# EasyEDA Pro project 测试用途.eprj, board ESP32 CH343下载电路
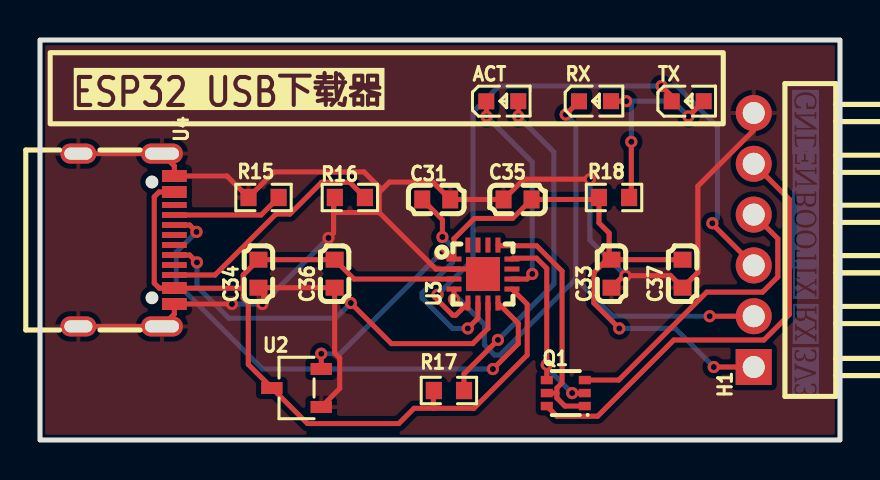
[diagram p7: board, top side]
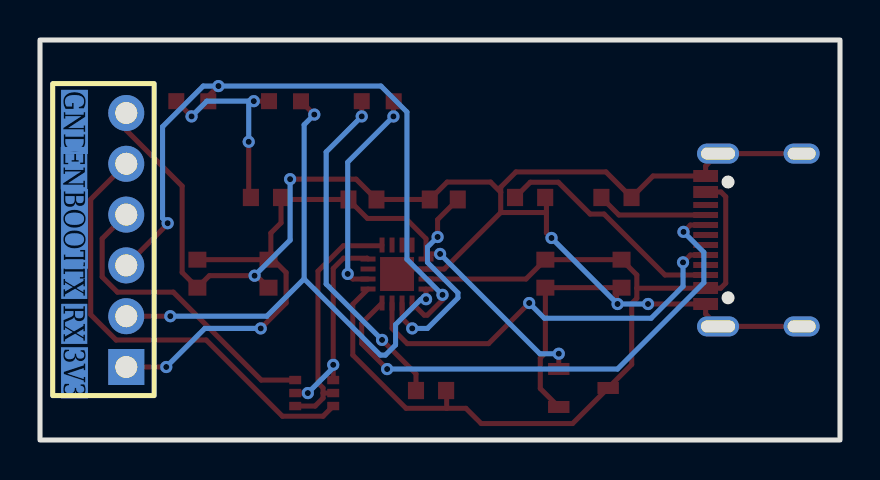
[diagram p8: board, bottom side, seen from below]

Outline 40 x 20 mm; copper layers: Top Layer, Bottom Layer. Coordinates in mm from the lower left corner of the outline.
Outline path: rectangle 0,20 40,0
Stack: Top Layer 0.035mm / Dielectric1 1.51mm FR4 er 4.5 / Bottom Layer 0.035mm

## Design rules (mm)
template: JLCPCB Capability(Two Layers Board)
spacing copperThickness1oz (default): track to track 0.102, other pairs 0.152 to 0.3
spacing copperThickness2oz: track to track 0.203, other pairs 0.152 to 0.3
track width copperThickness1oz (default): min 0.127, default 0.254, max 2.54
track width copperThickness2oz: min 0.203, default 0.254, max 2.54
differential pair differentialPair (default): width min 0.127, default 0.254, max 2.54; gap min 0.152, default 0.152
via viaSize (default): diameter min 0.5, default 0.61, max 10; hole min 0.3, default 0.305, max 6.3

## Placement (name value [footprint] x y rotation side)
ACT  XL-1608SURC-06  [LED0603-RD_RED]  23.11 16.94 0 top
C31  100nF  [C0603]  19.81 12.03 180 top
C33  1uF  [C0603]  28.57 8.32 90 top
C34  1uF  [C0603]  10.92 8.32 90 top
C35  1uF  [C0603]  23.88 12.03 0 top
C36  1uF  [C0603]  14.73 8.32 90 top
C37  22uF  [C0603]  32.13 8.32 90 top
H1  PZ254R-11-06P  [HDR-TH_6P-P2.54-H-M-W10.4]  35.69 10 90 top
Q1  UMH3N  [SC-70-6_L2.2-W1.3-P0.65-LS2.1-BR]  26.29 2.35 0 top
R15  5.1kΩ  [R0603]  11.18 12.13 0 top
R16  5.1kΩ  [R0603]  15.49 12.13 0 top
R17  5.1kΩ  [R0603]  20.45 2.47 0 top
R18  5.1kΩ  [R0603]  28.7 12.13 0 top
RX  XL-1608SURC-06  [LED0603-RD_RED]  27.75 16.94 0 top
TX  XL-1608SURC-06  [LED0603-RD_RED]  32.38 16.94 0 top
U2  ME6211A33M3G-N  [SOT-23-3_L2.9-W1.6-P1.90-LS2.8-BR]  12.83 2.6 0 top
U3  CH343P  [TQFN-16_L3.0-W3.0-P0.50-BL-EP1.7]  22.15 8.3 270 top
U4  GT-USB-7010ASV  [USB-C-SMD_G-SWITCH_GT-USB-7010ASV]  4.32 10 270 top

## Footprints (pads in the part's own frame, mm; a bottom-side part is the same pattern mirrored in y, then rotated)
C0603
  rect 0.8x0.9 smd: 1(-0.7,0) 2(0.7,0)
HDR-TH_6P-P2.54-H-M-W10.4
  rect 1.8x1.8 hole 1.1: 1(-6.35,0)
  round 1.8 hole 1.1: 2(-3.81,0) 3(-1.27,0) 4(1.27,0) 5(3.81,0) 6(6.35,0)
LED0603-RD_RED
  rect 0.8x0.8 smd: 1(-0.799,-0.004) 2(0.799,0.004)
R0603
  rect 0.806x0.864 smd: 1(-0.753,0) 2(0.753,0)
SC-70-6_L2.2-W1.3-P0.65-LS2.1-BR
  rect 0.6x0.42 smd: 1(0.95,-0.65) 2(0.95,0) 3(0.95,0.65) 4(-0.95,0.65) 5(-0.95,0) 6(-0.95,-0.65)
SOT-23-3_L2.9-W1.6-P1.90-LS2.8-BR
  rect 1.07x0.6 smd: 1(1.235,-0.95) 2(1.235,0.95) 3(-1.235,0)
TQFN-16_L3.0-W3.0-P0.50-BL-EP1.7
  rect 0.25x0.75 smd: 1(-0.749,-1.45) 2(-0.248,-1.45) 3(0.252,-1.45) 4(0.751,-1.45) 9(0.75,1.45) 10(0.25,1.45) 11(-0.25,1.45) 12(-0.749,1.45)
  rect 0.75x0.25 smd: 5(1.45,-0.75) 6(1.45,-0.25) 7(1.45,0.25) 8(1.45,0.75) 13(-1.45,0.75) 14(-1.45,0.25) 15(-1.45,-0.25) 16(-1.45,-0.75)
  rect 1.7x1.7 smd: 17(0.001,0)
USB-C-SMD_G-SWITCH_GT-USB-7010ASV
  oval 1x2.1 hole 0.6x1.7: 1(-4.32,1.78) 2(4.32,1.78)
  oval 1x1.8 hole 0.6x1.4: 3(4.32,-2.4) 4(-4.32,-2.4)
  rect 0.6x1.24 smd: A1B12(-3.2,2.4) A4B9(-2.4,2.4) B1A12(3.2,2.4) B4A9(2.4,2.4)
  rect 0.3x1.24 smd: A5(-1.25,2.4) A6(-0.25,2.4) A7(0.25,2.4) A8(1.25,2.4) B5(1.75,2.4) B6(0.75,2.4) B7(-0.75,2.4) B8(-1.75,2.4)

## Nets
As in the schematic.

Pads without a net: U3 11 14 15 16; U4 A8 B8

## Via types
v1: diameter 0.61, hole 0.305, Top Layer to Bottom Layer, 30 vias

## Routing (per net, layer and track width the routed paths; a pad name or vN(x,y) marks a point on that pad's centre or on a via; arc(x,y) is an arc through that point)
GND: length 86.3
  Top Layer w0.25: 16.96,11.37 19.79,8.55 U3.2 21.9,8.55 U3.17
  Top Layer w0.254: 14.68,11.37 16.96,11.37 16.96,12.39 ; 14.68,11.37 14.68,10.36 v1(14.42,10.1) ; 14.68,11.37 14.68,12.06 R16.1 ; 11.18,7.62 11.18,6.85 v1(11.12,6.8) ; 11.18,7.62 C36.1 14.73,4.35 14.99,4.1 14.99,2.58 14.06,1.65 ; 11.18,7.62 C34.1 ; v1(27.49,13.04) 24.19,13.04 C35.1 20.51,12.03 19.64,12.9 17.47,12.9 16.96,12.39 ; U4.3 U4.2 6.72,6.3 U4.B1A12 v1(9.6,6.8) ; H1.6 35.69,15.49 32.89,12.7 32.89,8.38 C37.1 31.53,8.22 v1(29.27,8.22) 29.17,8.22 C33.1 ; U4.4 U4.1 6.72,13.7 U4.A1B12 9.35,13.2 R15.1 11.7,13.4 16.2,13.4 16.96,12.64 16.96,12.39
  Bottom Layer w0.254: v1(9.6,6.8) v1(11.12,6.8) v1(14.42,10.1) ; v1(27.49,13.04) 27.49,9.99 v1(29.27,8.22)
VBUS: length 46.9
  Top Layer w0.25: R17.1 19.67,2.45 19.67,1.58 ; C36.2 15.7,8.05 U3.3 ; U2.3 13.37,0.82 17.94,0.82 18.7,1.58 19.67,1.58 ; 19.67,1.58 21.7,1.58 24.36,4.25 24.36,6.79 U3.9
  Top Layer w0.254: U4.A4B9 5.95,12.4 5.71,12.16 5.71,7.84 5.97,7.59 6.73,7.59 ; 10.16,7.59 10.16,7.08 10.41,6.83 10.41,3.78 U2.3 ; 10.16,7.59 10.16,8.25 C34.2 C36.2 ; 10.16,7.59 6.73,7.59 ; 6.73,7.59 U4.B4A9
VDD_3V3: length 37.5
  Top Layer w0.25: 24.58,12.03 23.63,11.08 21.71,11.08 20.7,10.06 U3.1 20.44,9.3 v1(20,9.3) ; 14.06,3.55 v1(14.06,4.31)
  Top Layer w0.254: v1(33.69,3.65) H1.1 ; v1(28.96,5.58) 27.69,6.85 27.69,8.37 28.46,9.13 ; 24.58,12.03 27.85,12.03 R18.1 27.95,10.86 28.46,10.35 28.46,9.13 ; 28.46,9.13 C33.2 C37.2
  Bottom Layer w0.25: v1(20,9.3) 15.01,4.31 v1(14.06,4.31)
  Bottom Layer w0.254: v1(33.69,3.65) 31.76,5.58 v1(28.96,5.58)
ACT#: length 10.7
  Top Layer w0.25: v1(24.61,8.3) 24.36,8.05 U3.10 ; v1(22.33,16.18) 22.33,16.69 ACT.1
  Bottom Layer w0.25: v1(24.61,8.3) 24.61,13.89 v1(22.33,16.18)
CHIP_EN: length 22.7
  Top Layer w0.254: Q1.6 25.85,1.19 27.88,1.19 31.69,5 36.19,5 37.47,6.27 37.47,12.03 H1.5
DTR: length 10.1
  Top Layer w0.25: U3.12 23.64,9.09 24.82,9.09 25.34,8.58 v1(25.34,3.76)
  Top Layer w0.254: Q1.4 v1(25.34,3.76) ; v1(26.61,2.35) Q1.2
  Bottom Layer w0.254: v1(25.34,3.76) 25.34,3.62 v1(26.61,2.35)
GPIO9/BOOT: length 15.4
  Top Layer w0.254: Q1.3 28.94,3 33.33,7.39 36.13,7.39 36.89,8.16 36.89,10.07 H1.4
GPIO20/U0RXD: length 29
  Top Layer w0.25: v1(26.29,16.27) RX.1 ; 20.7,7.55 v1(20.7,7.04)
  Top Layer w0.254: v1(33.49,6.19) H1.2
  Bottom Layer w0.25: v1(26.29,16.27) 26.79,15.76 26.79,8.06 22.98,4.25 22.73,4.25 22.22,4.75 22.22,5.77 20.95,7.04 v1(20.7,7.04)
  Bottom Layer w0.254: v1(33.49,6.19) 28.66,6.19 26.79,8.06
GPIO21/U0TXD: length 34.7
  Top Layer w0.25: v1(31.08,17.7) 31.59,17.19 TX.1 ; v1(19.87,7.26) 19.87,7 20.64,6.24 20.79,6.24 21.4,6.85
  Top Layer w0.254: v1(33.62,10.84) 33.62,10.8 H1.3
  Bottom Layer w0.25: v1(31.08,17.7) 22.95,17.7 21.65,16.4 21.65,9.03 v1(19.87,7.26)
  Bottom Layer w0.254: v1(31.08,17.7) 31.84,17.7 33.87,15.67 33.87,11.09 v1(33.62,10.84)
RTS: length 12.3
  Top Layer w0.25: 22.9,9.75 22.93,9.71 24.83,9.71 26.1,8.44 26.1,2.86 25.85,2.6 25.85,2.35
  Top Layer w0.254: Q1.1 26.24,1.7 25.85,2.09 25.85,2.35 Q1.5
USB_CC1: length 5.6
  Top Layer w0.254: R15.2 11.05,11.25 U4.A5
USB_CC2: length 11.8
  Top Layer w0.254: R16.2 15.49,12.89 14.08,12.89 12.49,11.3 11.8,11.3 8.75,8.25 U4.B5
USB_DN2: length 26.1
  Top Layer w0.25: v1(22.64,3.55) 23.91,4.82 23.91,5.83 U3.8 ; U4.B7 7.48,10.75 v1(7.82,10.41)
  Bottom Layer w0.25: v1(7.82,10.41) 6.81,9.39 6.81,7.86 11.13,3.55 v1(22.64,3.55)
USB_DP2: length 20.4
  Top Layer w0.25: v1(15.54,6.85) 17.57,4.82 21.64,4.82 22.4,5.58 22.4,6.85 ; U4.B6 7.48,9.25 v1(7.85,8.88)
  Bottom Layer w0.25: v1(7.85,8.88) 7.85,7.68 9.44,6.09 14.78,6.09 v1(15.54,6.85)
$1N454: length 10.6
  Top Layer w0.25: v1(20.12,10.15) 20.12,11.02 C31.2 ; U3.6 21.9,6.09 v1(21.39,5.58)
  Bottom Layer w0.25: v1(20.12,10.15) 20.63,9.64 20.63,8.88 19.1,7.36 19.1,7.1 20.63,5.58 v1(21.39,5.58)
$1N993: length 17.1
  Top Layer w0.254: v1(22.9,5) 21.2,3.31 R17.2 ; ACT.2 v1(23.91,16.18)
  Bottom Layer w0.254: v1(22.9,5) 25.69,7.8 25.69,14.4 v1(23.91,16.18)
$1N997: length 10.1
  Top Layer w0.254: RX.2 v1(29.31,16.94) ; v1(29.56,14.91) 29.56,12.24 R18.2 ; v1(32.42,16.18) TX.2
  Bottom Layer w0.254: v1(29.31,16.94) 29.56,16.94 ; 29.56,16.94 31.66,16.94 v1(32.42,16.18) ; 29.56,16.94 v1(29.56,14.91)

## Copper pours and planes (outline as drawn; the poured copper is in the pictures)
GND on Top Layer: -2.41,21.52 43.69,21.52 43.69,-1.72 -2.41,-1.72

## Text on the board
Bottom Layer: GND | BOOT | 3V3 | EN | TX | RX
Top Silkscreen Layer: ESP32 USB下载器
